# EAGLE design tweeq-STAMP_I2C_EEPROM v1 (EAGLE 7.2.0)
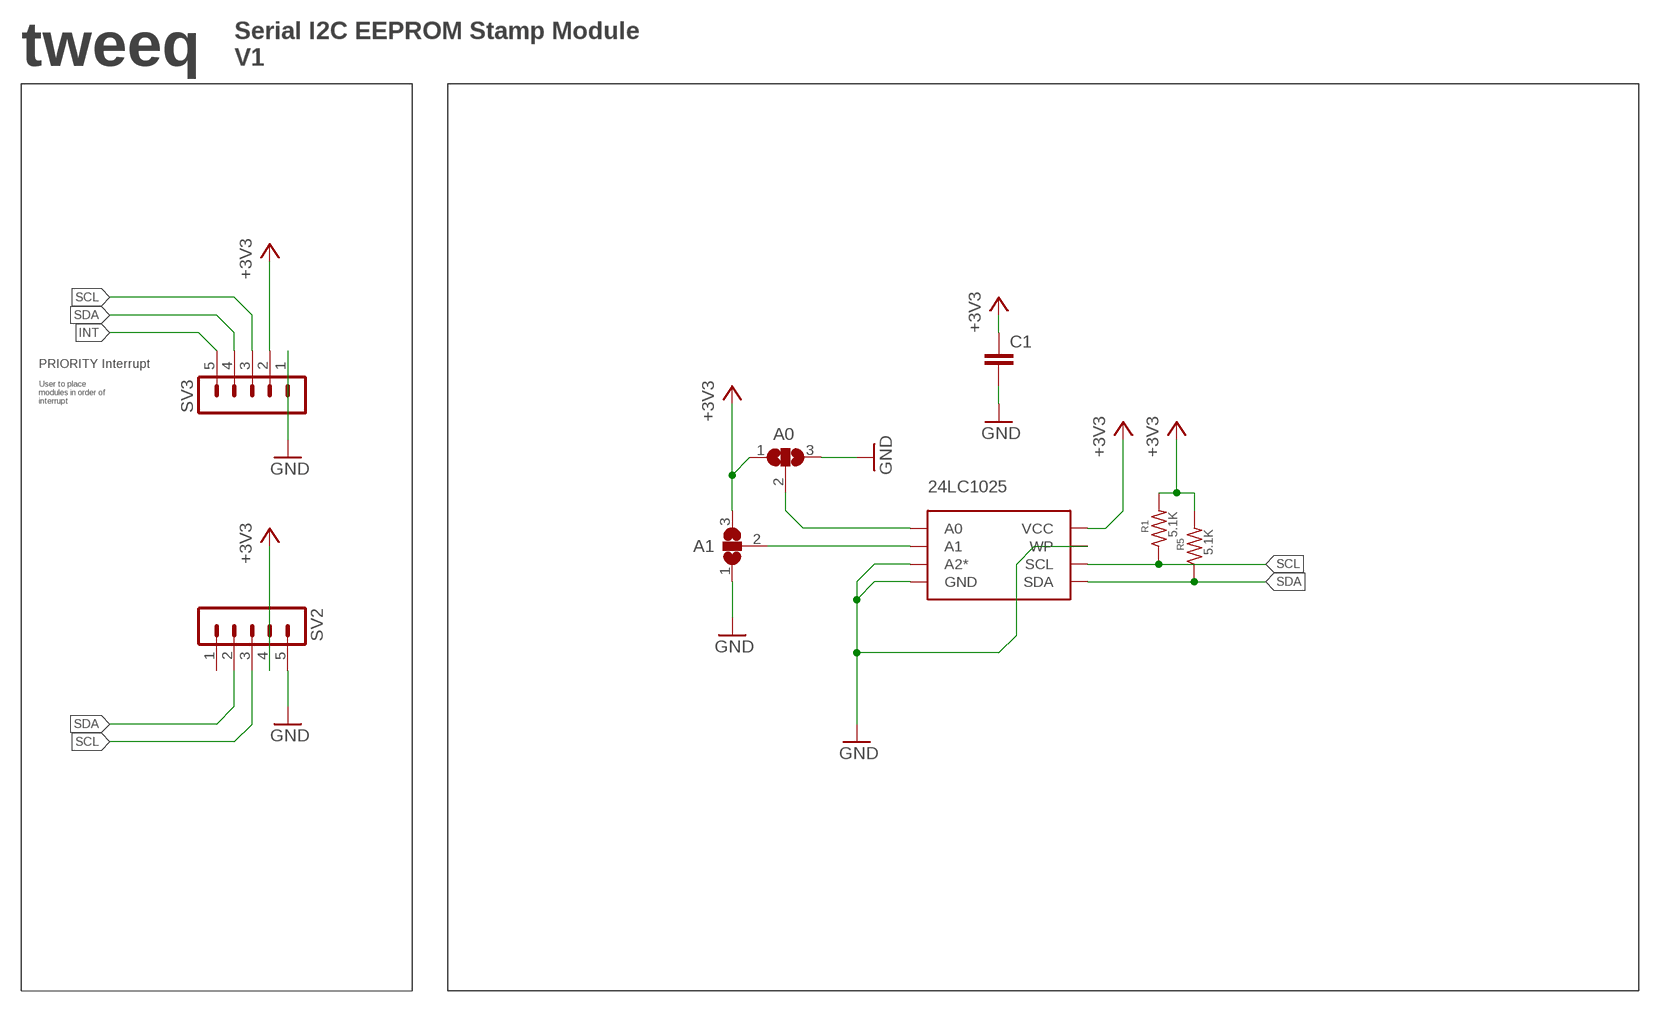
[diagram p0: schematic, sheet 1]

## Parts
24LC1025  24LC1025  [SOIC8(W)]
A0  JUMPER_SJ2WS  [JUMPER_SJ_S]
A1  JUMPER_SJ2WS  [JUMPER_SJ_S]
C1  C-EUC0402K  [C0402K]
R1  5.1K  R-US_R0402  [R0402]
R5  5.1K  R-US_R0402  [R0402]
SV2  M05-1STAMP  [1X05-1.5MM-STAMP]
SV3  M05-1STAMP  [1X05-1.5MM-STAMP]

## Nets
+3V3: 24LC1025.8(VCC) A0.1 A1.3 C1.1 R1.2 R5.2 SV2.4 SV3.2
GND: 24LC1025.3(A2*) 24LC1025.4(GND) 24LC1025.7(WP) A0.3 A1.1 C1.2 SV2.5 SV3.1
INT: SV3.5
N$4: 24LC1025.1(A0) A0.2
N$5: 24LC1025.2(A1) A1.2
SCL: 24LC1025.6(SCL) R1.1 SV2.3 SV3.3
SDA: 24LC1025.5(SDA) R5.1 SV2.2 SV3.4
Unconnected: SV2.1

## Notes on the sheet
- tweeq
- Serial I2C EEPROM Stamp Module
  V1
- PRIORITY Interrupt
- User to place 
  modules in order of 
  interrupt

## Library data of the parts
24LC1025 = AISCube:24LC1025: 24AA1025/24LC1025/24FC1025 1024K I2C™ Serial EEPROM 128K x 8 (1024K bit) Serial Electrically Erasable PROM
A0 A1 = AISCube:JUMPER_SJ2W: SMD solder JUMPER
C1 = AISCube:C-EU: CAPACITOR, European symbol
R1 R5 = rcl:R-US_: RESISTOR, American symbol
SV2 SV3 = AISCube:M05-1: PIN HEADER Standard 0.1" header pin 5 pins - 1 way

## Board
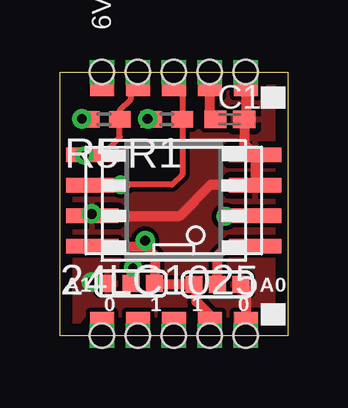
[diagram p1: board, top side]
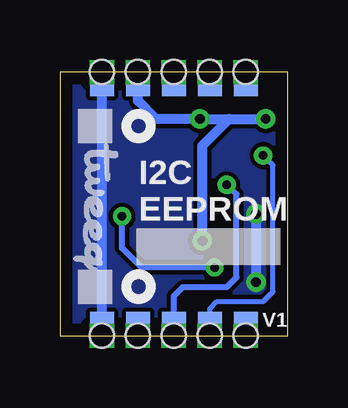
[diagram p2: board, bottom side, seen from below]

Size 9.5 x 11 mm. Coordinates in mm from the lower left corner, seen from the top.
Outline: 0,11 9.5,11 9.5,0 0,0 0,11
Copper layers (1*16): Top 0.0356mm / dielectric 1.5011mm / Bottom 0.0356mm
Design rules "AISCube": minimum track width 7mil, minimum drill 14mil, track to track 7mil, track to pad 7mil, pad to pad 7mil, via to via 7mil, smd to smd 0mil, copper to edge 20mil, drill to drill 8mil, minimum pad ring 10mil, minimum via ring 8mil, stop-mask expansion 4mil, vias tented up to drill 32mil, thermal gap 10mil

### Footprints (pad centres in the part's own frame; a part is rotated, then mirrored left to right if it is on the bottom)
SOIC8(W) = smd 2.2 x 0.6: 1 -3.397,1.905; 2 -3.397,0.635; 3 -3.397,-0.635; 4 -3.397,-1.905; 5 3.397,-1.905; 6 3.397,-0.635; 7 3.397,0.635; 8 3.397,1.905
JUMPER_SJ_S = smd 0.7 x 0.7: 1 -0.974,-0.02; 2 0,-0.02; 3 0.974,-0.02
C0402K = smd 0.925 x 0.74: 1 -0.6,0; 2 0.6,0
R0402 = smd 0.9 x 0.7: 1 -0.65,0; 2 0.65,0
1X05-1.5MM-STAMP = drill 0.5 pad 1 square: 1 -3,0; 2 -1.5,0; 3 0,0; 4 1.5,0; 5 3,0 | smd 1 x 0.6: P$1 -3,0.7; P$2 -1.5,0.7; P$3 0,0.7; P$4 1.5,0.7; P$5 3,0.7 | smd 1 x 0.6 bottom: P$6 -3,0.7; P$7 -1.5,0.7; P$8 0,0.7; P$9 1.5,0.7; P$10 3,0.7 | hole 1: -3,0; -1.5,0; 0,0; 1.5,0; 3,0

### Placement (x,y rotation side)
24LC1025  4.75,5.64 180 top
A0  6.57,2.16 0 top
A1  2.97,2.2 0 top
C1  7.09,9.03 0 top
R1  4.46,9.03 180 top
R5  1.85,9.03 180 top
SV2  4.75,0 0 top
SV3  4.75,11 180 top
U$1  [TWEEQ-LOGO-S]  8.94,8.03 270 bottom

### Tracks (layer width: path | path; a pad name or v marks a point on that pad's centre or on a via)
+3V3  (via drill 0.41)
  Top 0.406: 24LC1025.8 3.58,3.73 | 3.58,3.73 3.96,3.35 3.96,2.19 A1.3 3.98,2.14 A0.1 5.69,2.05 5.69,1.42 6.25,0.86 SV2.4 | v0.91,9.04 1.18,9.04 R5.2 | R1.2 3.67,9.03 v3.66,9.04 | C1.1 6.25,9.27 SV3.2 | 3.58,3.73 3.58,3.93 v3.56,3.96
  Bottom 0.406: 2.44,9.04 v3.66,9.04 5.49,9.04 6.25,9.81 SV3.2 | 2.44,9.04 v0.91,9.04 | v3.56,3.96 3.56,7.92 2.44,9.04
GND  (via drill 0.41)
  Top 0.406: SV3.1 7.75,9.09 C1.2 7.69,8 24LC1025.4 24LC1025.3 8.12,6.3 6.3,6.3 5,5 24LC1025.7 1.2,5 v1.32,5.08 | A0.3 7.75,1.94 SV2.5 | v1.32,2.23 1.94,2.23 A1.1
  Bottom 0.406: SV2.5 SV3.1 | v1.32,5.08 v1.32,2.23
  pour Top: 9.3,10.8 9.3,0.18 0.15,0.18 0.15,10.8
  pour Bottom: 9.3,0.18 9.3,10.8 0.15,10.8 0.15,0.18
N$4
  Top 0.406: A0.2 6.57,3.32 6.98,3.73 24LC1025.1
N$5  (via drill 0.36)
  Top 0.254: v6.91,4.98 8.12,4.98 24LC1025.2 | A1.2 2.97,2.77 v3.05,2.85
  Bottom 0.254: v3.05,2.85 6.1,2.85 6.91,3.66 v6.91,4.98
SCL  (via drill 0.36)
  Top 0.254: SV3.3 5.11,10.64 R1.1 5.11,6.73 4.67,6.3 v2.54,6.3 1.38,6.3 24LC1025.6
  Bottom 0.254: SV2.3 4.75,1.65 4.37,2.03 2.54,2.03 2.13,2.44 2.13,5.89 v2.54,6.3
SDA  (via drill 0.36)
  Top 0.203: v1.02,7.52 1.73,7.52 1.98,7.77
  Top 0.254: 24LC1025.5 1.75,7.54 1.98,7.77 2.5,8.29 R5.1 2.5,9.41 2.95,9.86 2.95,10.7 SV3.4
  Bottom 0.203: SV2.2 3.25,1.12 2.95,1.42 1.02,1.42 0.61,1.83 0.61,7.11 v1.02,7.52

### Text on the board
tPlace: A1 | A0 | 0 | 1 | 1 | 0
bPlace: I2C / EEPROM | V1
tNames: 6V-9V DC | ON
bNames: Breadboard | V-Reg | Module